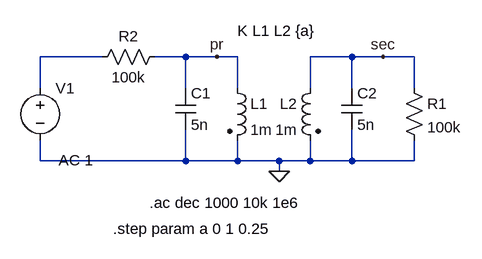
[diagram p0: schematic themeltspice_updatedexample.asc]
themeltspice_updatedexample.asc, the LTspice schematic file:
Version 4
SHEET 1 1204 680
WIRE 576 320 480 320
WIRE 704 320 656 320
WIRE 752 320 704 320
WIRE 784 320 752 320
WIRE 960 320 896 320
WIRE 1008 320 960 320
WIRE 1056 320 1008 320
WIRE 480 368 480 320
WIRE 704 368 704 320
WIRE 784 368 784 320
WIRE 896 368 896 320
WIRE 960 368 960 320
WIRE 1056 368 1056 320
WIRE 480 480 480 448
WIRE 704 480 704 432
WIRE 704 480 480 480
WIRE 784 480 784 448
WIRE 784 480 704 480
WIRE 848 480 784 480
WIRE 896 480 896 448
WIRE 896 480 848 480
WIRE 960 480 960 432
WIRE 960 480 896 480
WIRE 1056 480 1056 448
WIRE 1056 480 960 480
WIRE 848 496 848 480
FLAG 848 496 0
FLAG 752 320 pr
FLAG 1008 320 sec
SYMBOL voltage 480 352 R0
WINDOW 3 28 127 Left 2
SYMATTR InstName V1
SYMATTR Value AC 1
SYMBOL Res 1040 352 R0
SYMATTR InstName R1
SYMATTR Value 100k
SYMBOL Res 560 336 R270
WINDOW 0 32 56 VTop 2
WINDOW 3 0 56 VBottom 2
SYMATTR InstName R2
SYMATTR Value 100k
SYMBOL Cap 688 368 R0
SYMATTR InstName C1
SYMATTR Value 5n
SYMBOL Cap 944 368 R0
SYMATTR InstName C2
SYMATTR Value 5n
SYMBOL ind2 768 352 R0
SYMATTR InstName L1
SYMATTR Value 1m
SYMBOL ind2 912 352 M0
SYMATTR InstName L2
SYMATTR Value 1m
TEXT 648 544 Left 2 !.ac dec 1000 10k 1e6
TEXT 592 584 Left 2 !.step param a 0 1 0.25
TEXT 784 280 Left 2 !K L1 L2 {a}

The netlist it stands for:
* themeltspice_updatedexample.asc
V1 N001 0 AC 1
R1 sec 0 100k
R2 N001 pr 100k
C1 pr 0 5n
C2 sec 0 5n
L1 pr 0 1m
L2 sec 0 1m
.ac dec 1000 10k 1e6
.step param a 0 1 0.25
K L1 L2 {a}
.backanno
.end